# EAGLE design FTDI (EAGLE 7.3.0)
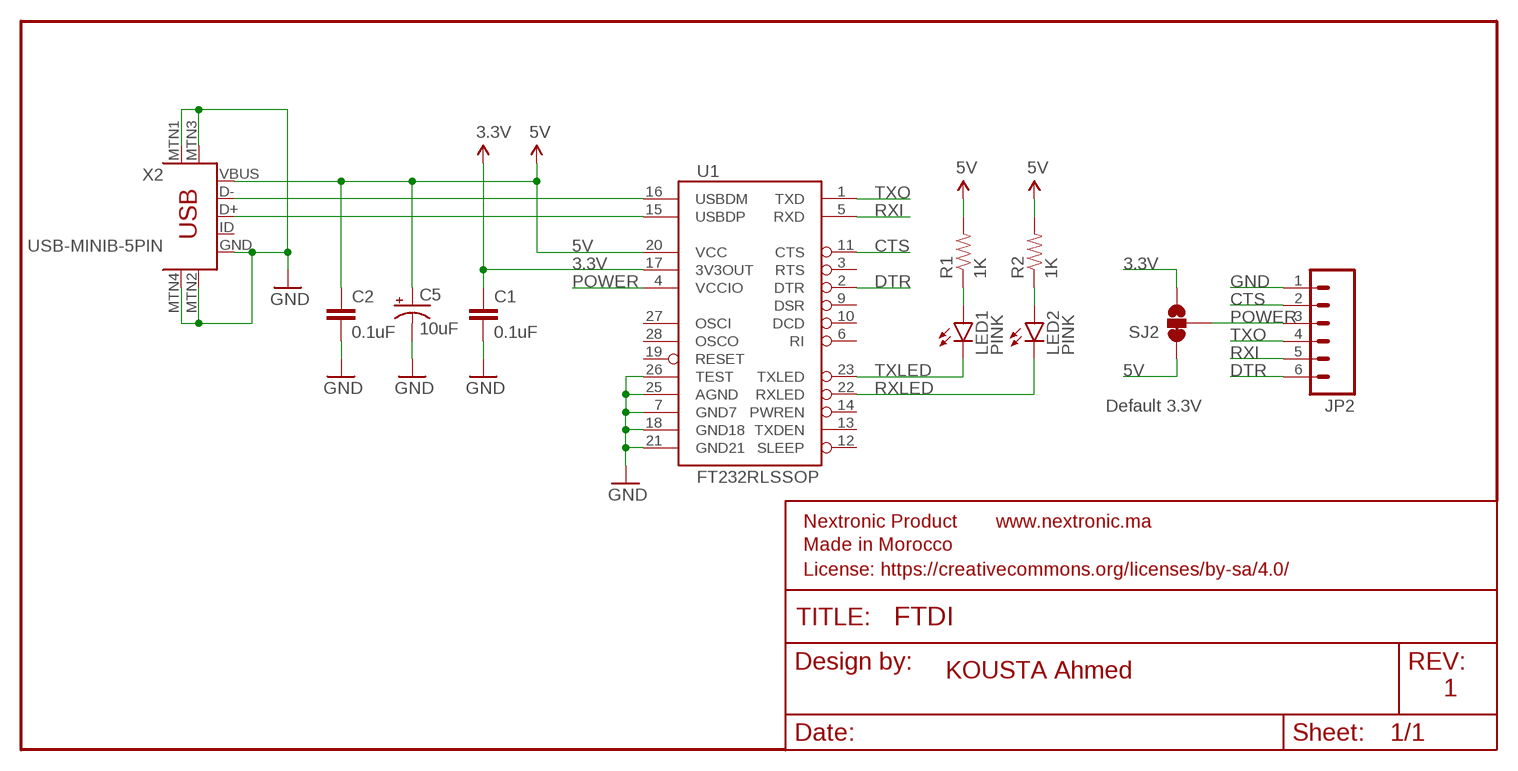
[diagram p0: schematic, sheet 1]

## Parts
C1  0.1uF  0.1UF-25V-5%(0603)  [0603-CAP]
C2  0.1uF  0.1UF-25V-5%(0603)  [0603-CAP]
C5  10uF  CAP_POL1206  [EIA3216]
FRAME2  FRAME-LETTER  [CREATIVE_COMMONS]
JP2  M06SILK_FEMALE_PTH  [1X06]
LED1  PINK  LED-PINK1206  [LED-1206]
LED2  PINK  LED-PINK1206  [LED-1206]
R1  1K  1KOHM-1/10W-1%(0603)  [0603-RES]
R2  1K  1KOHM-1/10W-1%(0603)  [0603-RES]
SJ2  SOLDERJUMPER_2WAYS  [SJ_3]
U1  FT232RLSSOP  [SSOP28DB]
X2  USB-MINIB-5PIN  [USB-MINIB]

## Nets
3.3V [power]: C1.1 SJ2.3 U1.17(3V3OUT)
5V: C2.1 C5.A(+) R1.2 R2.2 SJ2.1 U1.20(VCC) X2.VBUS
CTS: JP2.2 U1.11(CTS)
DTR: JP2.6 U1.2(DTR)
GND [power]: C1.2 C2.2 C5.C(-) JP2.1 U1.7(GND7) U1.18(GND18) U1.21(GND21) U1.25(AGND) U1.26(TEST) X2.GND X2.MTN1(MTN2) X2.MTN2(MTN3) X2.MTN3(MTN1) X2.MTN4
N$1: LED1.A R1.1
N$2: LED2.A R2.1
POWER: JP2.3 SJ2.2 U1.4(VCCIO)
RXI: JP2.5 U1.5(RXD)
RXLED: LED2.C U1.22(RXLED)
TXLED: LED1.C U1.23(TXLED)
TXO: JP2.4 U1.1(TXD)
USB_D+: U1.15(USBDP) X2.D+
USB_D-: U1.16(USBDM) X2.D-
Unconnected: U1.3(RTS) U1.6(RI) U1.9(DSR) U1.10(DCD) U1.12(SLEEP) U1.13(TXDEN) U1.14(PWREN) U1.19(RESET) U1.27(OSCI) U1.28(OSCO) X2.ID

## Notes on the sheet
- Default 3.3V
- KOUSTA Ahmed
- 1

## Library data of the parts
C1 C2 = SparkFun-Capacitors:0.1UF-25V-5%(0603): CAP-08604; PROD_ID: CAP-08604
C5 = SparkFun:CAP_POL: Capacitor Polarized These are standard SMD and PTH capacitors. Normally 10uF, 47uF, and 100uF in electrolytic and tantalum varieties. Always verify the external diameter of the through hole cap, it varies with capacity, voltage, and manufacturer. The EIA devices should be standard.
FRAME2 = SparkFun-Aesthetics:FRAME-LETTER: Schematic Frame Standard 8.5x11 US Letter frame
JP2 = SparkFun-Connectors:M06: Header 6 Standard 6-pin 0.1" header. Use with straight break away headers (SKU : PRT-00116), right angle break away headers (PRT-00553), swiss pins (PRT-00743), machine pins (PRT-00117), and female headers (PRT-00115). Molex polarized connector foot print use with SKU : PRT-08094 with associated crimp pins and housings. NOTES ON THE VARIANTS LOCK and LOCK_LONGPADS... This footprint was designed to help hold the alignment of a through-hole component (i.e. 6-pin header) while soldering it into place. You may notice that each hole has been shifted either up or down by 0.005 of an inch from it's more standard position (which is a perfectly straight line). This slight alteration caused the pins (the squares in the middle) to touch the edges of the holes. Because they are alternating, it causes a "brace" to hold the component in place. 0.005 has proven to be the perfect amount of "off-center" position when using our standard breakaway headers. Although looks a little odd when you look at the bare footprint, once you have a header in there, the alteration is very hard to notice. Also,if you push a header all the way into place, it is covered up entirely on the bottom side. This idea of altering the position of holes to aid alignment will be further integrated into the Sparkfun Library for other footprints. It can help hold any component with 3 or more connection pins.; PROD_ID: CONN-08437
LED1 LED2 = SparkFun-LED:LED-PINK: Various Pink LEDs Pink LEDs used in SFE Production LILYPAD- DIO-10415; PROD_ID: DIO-10415
R1 R2 = SparkFun-Resistors:1KOHM-1/10W-1%(0603): RES-07856; PROD_ID: RES-07856
SJ2 = SparkFun:SOLDERJUMPER_2WAY: Solder Jumper 2 way solder jumper
U1 = SparkFun:FT232RL: USB UART FT232RL 4th Generation USB UART (USB <-> Serial) Controller. Spark Fun Electronics SKU : COM-00650
X2 = SparkFun-Connectors:USB-MINIB: Mini-USB "B" connector with 5th pin broken out. Created new symbol breaking out 5th "ID" pin in mini/micro USB connector spec. See: http://en.wikipedia.org/wiki/Mini_usb#Cables. Uses same footprint as 4-pin symbol. Also added pins to connect to mounting / shield pads if required (probably not generally needed as signals aren't shielded once they leave the connector).; PROD_ID: CONN-08193

## Net classes
0 default: width 0.203 mm
1 power: width 0.254 mm

## Board
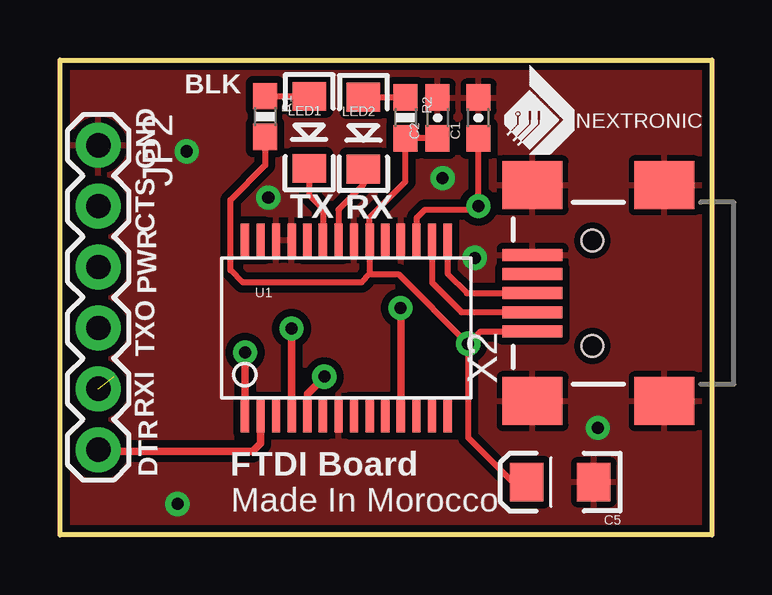
[diagram p1: board, top side]
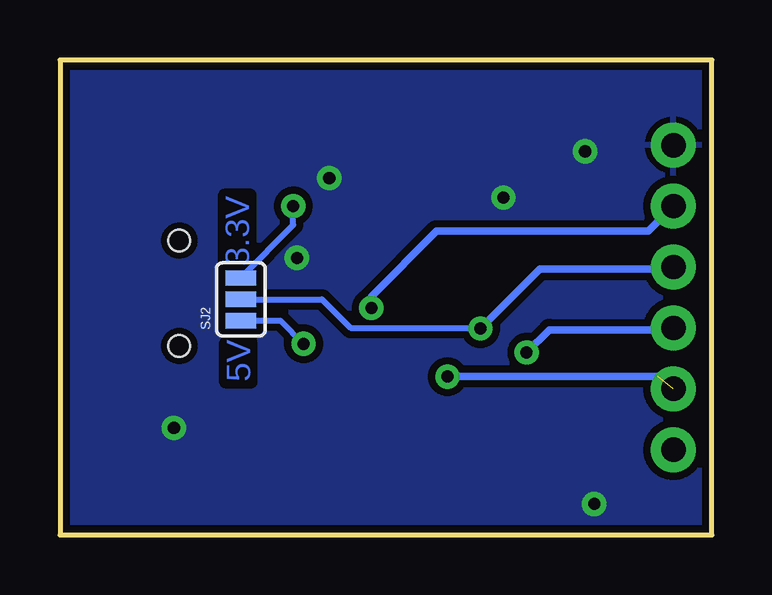
[diagram p2: board, bottom side, seen from below]

Size 27.18 x 19.81 mm. Coordinates in mm from the lower left corner, seen from the top.
Outline: 27.18,19.81 27.18,0 0,0 0,19.81 27.18,19.81
Copper layers (1*16): Top 0.035mm / dielectric 1.5mm / Bottom 0.035mm
Design rules "SparkFun": minimum track width 8mil, minimum drill 20mil, track to track 8mil, track to pad 8mil, pad to pad 8mil, via to via 8mil, smd to smd 8mil, copper to edge 8mil, drill to drill 8mil, minimum pad ring 12mil, minimum via ring 10mil, stop-mask expansion 4mil, vias tented up to drill 20mil, thermal gap 10mil

### Footprints (pad centres in the part's own frame; a part is rotated, then mirrored left to right if it is on the bottom)
0603-CAP = smd 1.1 x 1: 1 -0.85,0; 2 0.85,0
EIA3216 = smd 1.4 x 1.6: A 1.4,0; C -1.4,0
1X06 = drill 1.016 pad 1.88: 1 0,0; 2 2.54,0; 3 5.08,0; 4 7.62,0; 5 10.16,0; 6 12.7,0
LED-1206 = smd 1.2 x 1.4: A -1.5,0; C 1.5,0
0603-RES = smd 1.1 x 1: 1 -0.85,0; 2 0.85,0
SJ_3 = smd 0.635 x 1.27: 1 -0.889,0; 2 0,0; 3 0.889,0
SSOP28DB = smd 0.348 x 1.397: 1 -4.225,-3.656; 2 -3.575,-3.656; 3 -2.925,-3.656; 4 -2.275,-3.656; 5 -1.625,-3.656; 6 -0.975,-3.656; 7 -0.325,-3.656; 8 0.325,-3.656; 9 0.975,-3.656; 10 1.625,-3.656; 11 2.275,-3.656; 12 2.925,-3.656; 13 3.575,-3.656; 14 4.225,-3.656; 15 4.225,3.656; 16 3.575,3.656; 17 2.925,3.656; 18 2.275,3.656; 19 1.625,3.656; 20 0.975,3.656; 21 0.325,3.656; 22 -0.325,3.656; 23 -0.975,3.656; 24 -1.625,3.656; 25 -2.275,3.656; 26 -2.925,3.656; 27 -3.575,3.656; 28 -4.225,3.656
USB-MINIB = smd 2.5 x 0.5: D+ 2.5,0; D- 2.5,0.8; GND 2.5,-1.6; ID 2.5,-0.8; VBUS 2.5,1.6 | smd 2.5 x 2: MTN1 -3,4.5; MTN2 2.5,4.5; MTN3 -3,-4.5; MTN4 2.5,-4.5 | hole 0.9: 0,2.2; 0,-2.2

### Placement (x,y rotation side)
C1  17.45,17.4 90 top
C2  15.75,17.4 90 top
C5  20.85,2.21 180 top
FRAME2  -0.38,-0.16 0 top
JP2  1.6,16.26 270 top
LED1  10.39,16.79 270 top
LED2  12.65,16.76 270 top
R1  8.56,17.45 270 top
R2  14.4,17.4 270 top
SJ2  19.63,9.83 90 bottom
U1  11.94,8.64 0 top
X2  22.2,10.08 180 top

### Tracks (layer width: path | path; a pad name or v marks a point on that pad's centre or on a via)
3.3V  (via drill 0.5)
  Top 0.254: 17.45,16.28 C1.1 v17.45,13.72 17.3,13.56 15.21,13.56 14.88,13.23 14.88,12.31 U1.17
  Bottom 0.254: v17.45,13.72 17.45,12.93 19.63,10.74 SJ2.3
5V  (via drill 0.5)
  Top 0.254: 12.91,10.88 U1.20 12.91,13.24 14.4,14.73 R2.2 C2.1 | 12.91,10.88 12.57,10.54 7.62,10.54 7.11,11.05 7.11,13.97 8.56,15.42 R1.2 | X2.VBUS 17.53,8.48 v17.02,7.98 | X2.VBUS | C5.A 18.87,2.21 17.02,4.06 v17.02,7.98 | 12.91,10.88 14.11,10.88 v17.02,7.98
  Bottom 0.254: SJ2.1 17.98,8.94 v17.02,7.98
CTS  (via drill 0.5)
  Top 0.254: 14.2,4.99 U1.11
  Top 0.305: v14.2,9.47 14.21,9.46 U1.11
  Bottom 0.305: v14.2,9.47 14.2,9.96 11.48,12.67 2.64,12.67 JP2.2
DTR
  Top 0.254: U1.2
  Top 0.305: U1.2 8.36,3.82 8.03,3.48 1.68,3.48 JP2.6
GND  (via drill 0.51)
  other vias: 22.43,4.47 8.69,14.07 4.9,1.3 5.28,16 17.3,11.56 15.95,14.88
  pour Bottom (isolate 0.305): 0,-0.03 0,19.84 27.18,19.84 27.18,-0.03
  pour Top (isolate 0.305): 0,-0.03 -0.25,19.84 26.92,19.84 27.18,-0.03
N$1
  Top 0.254: LED1.A R1.1
N$2
  Top 0.254: LED2.A 14.39,18.26 R2.1
POWER  (via drill 0.5)
  Top 0.305: v9.65,8.61 9.65,4.99 U1.4
  Bottom 0.254: SJ2.2 16.26,9.83 15.06,8.64 9.68,8.64 v9.65,8.61
  Bottom 0.305: v9.65,8.61 7.16,11.1 1.6,11.1 JP2.3
RXI  (via drill 0.5)  (1 unrouted)
  Top 0.305: v11.02,6.6 10.31,5.89 U1.5
  Bottom 0.305: 2.26,6.6 v11.02,6.6
RXLED
  Top 0.254: LED2.C 12.65,14.6 11.61,13.56 U1.22
TXLED
  Top 0.254: LED1.C 10.39,14.17 10.97,13.59 10.97,12.3 U1.23
TXO  (via drill 0.5)
  Top 0.305: v7.72,7.62 U1.1
  Bottom 0.305: v7.72,7.62 6.78,8.56 1.6,8.56 JP2.4
USB_D+
  Top 0.254: U1.15 16.16,10.89 16.97,10.08 X2.D+
USB_D-
  Top 0.254: U1.16 15.51,10.52 16.74,9.3 19.69,9.3 X2.D-

### Text on the board
Bottom: 3.3V | 5V
tPlace: BLK | NEXTRONIC | GND | TX | RX | CTS | PWR | TXO | RXI | DTR | FTDI Board | Made In Morocco